# EAGLE schematic UpDown (EAGLE 7.0.0)
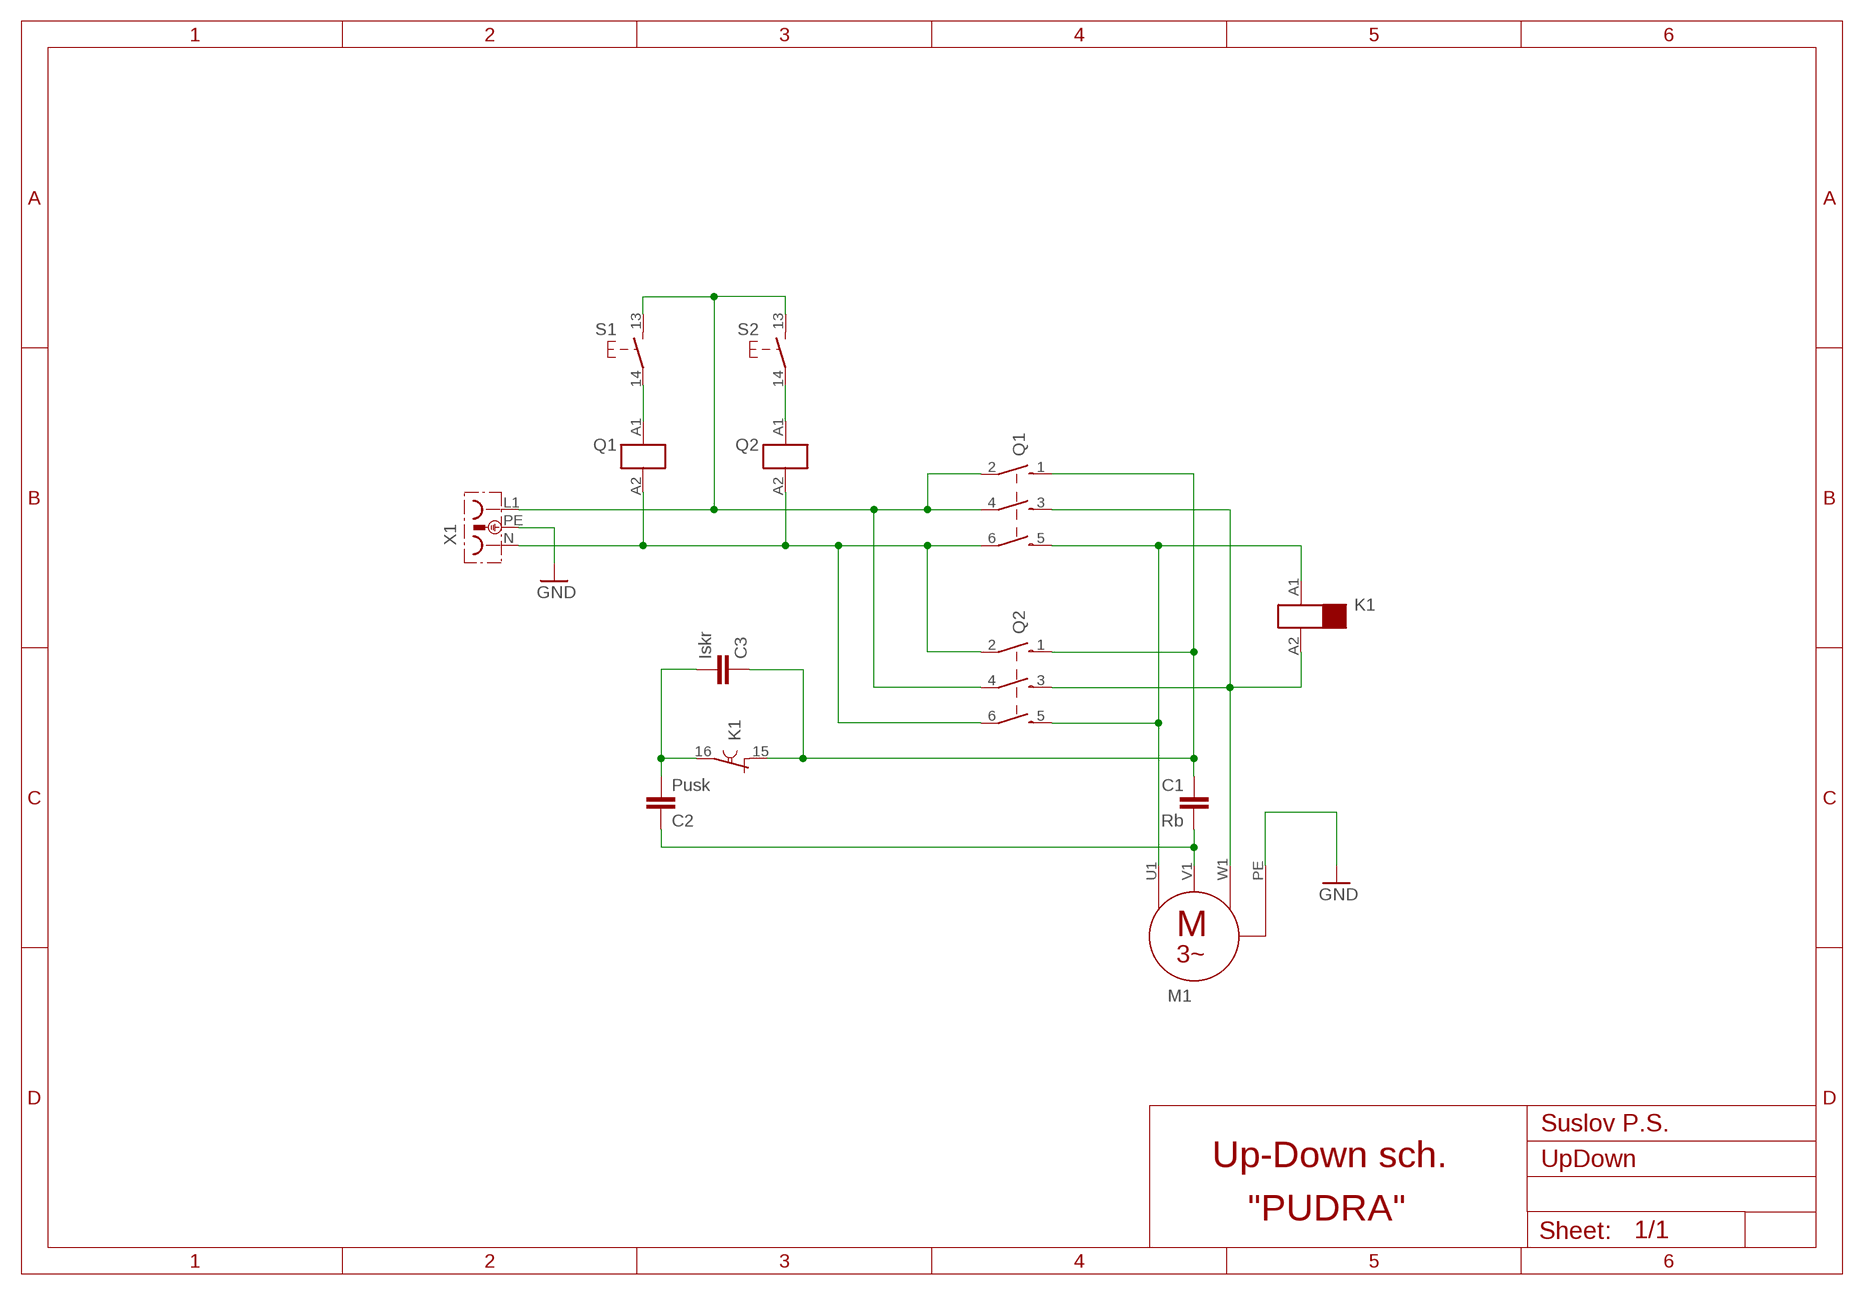
[diagram p0: schematic, sheet 1]

## Parts
C1  Rb  C-EU025-024X044  [C025-024X044]
C2  Pusk  C-EU025-024X044  [C025-024X044]
C3  Iskr  C-EU025-024X044  [C025-024X044]
K1  HILFSSCHUETZ_SCHLIESST_VERZOEGERT_15-16  [HILFSSCHUETZ_SCHLIESST_VERZOEGERT_15-16]
M1  MOTOR_3-POL_PE  [MOTOR_3-POL_PE]
Q1  HAUPTSCHUETZ_3-POL  [HAUPTSCHUETZ_3-POL]
Q2  HAUPTSCHUETZ_3-POL  [HAUPTSCHUETZ_3-POL]
S1  TASTER_SCHLIESSER  [EINTASTER]
S2  TASTER_SCHLIESSER  [EINTASTER]
X1  ~220v  STECKDOSE  [STECKDOSE]

## Nets
GND: M1.PE X1.PE
N$1: K1.A1 M1.U1 Q1.5 Q2.5
N$2: Q1.6 Q1.A2 Q2.2 Q2.6 Q2.A2 X1.N
N$3: Q1.2 Q1.4 Q2.4 S1.13 S2.13 X1.L1
N$4: K1.A2 M1.W1 Q1.3 Q2.3
N$5: C1.2 C2.1 M1.V1
N$6: C1.1 C3.1 K1.15 Q1.1 Q2.1
N$7: C2.2 C3.2 K1.16
N$9: Q1.A1 S1.14
N$10: Q2.A1 S2.14

## Notes on the sheet
- Suslov P.S.
- Up-Down sch.
- "PUDRA"

## Library data of the parts
C1-C3 = rcl:C-EU: CAPACITOR, European symbol
K1 = e-schuetze-relais:HILFSSCHUETZ_SCHLIESST_VERZOEGERT_15-16: Hilfsschütz mit Öffner, schließt verzögert
M1 = e-motoren:MOTOR_3-POL_PE: 3-Phasen-Motor mit PE
Q1 Q2 = e-schuetze-relais:HAUPTSCHUETZ_3-POL: Hauptschütz mit 3 Schließern
S1 S2 = e-schalter:TASTER_SCHLIESSER: Ein-Taster (Arbeitskontakt)
X1 = e-steckverbinder:STECKDOSE: Steckdose mit Schutzleiter